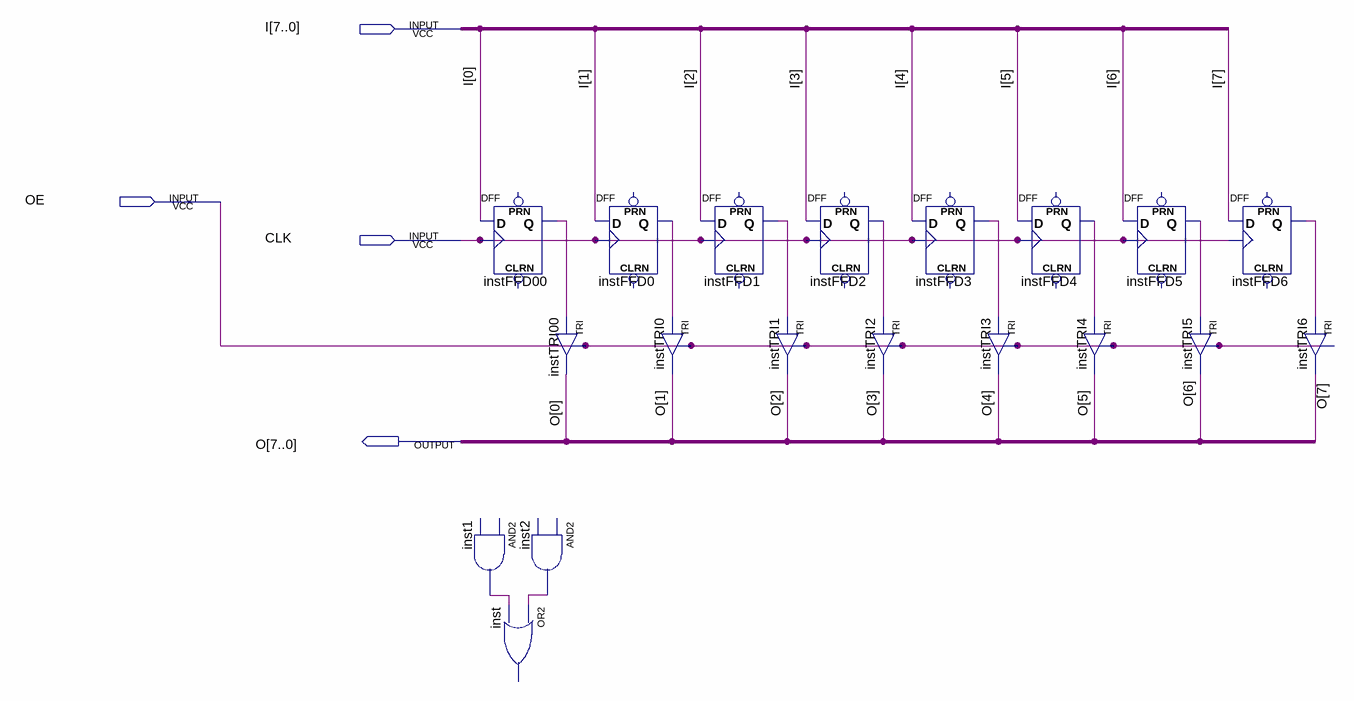
[diagram p0: schematic sheet]
// Quartus schematic Register8bitBasic.bdf as structural Verilog: 19 symbols, 4 pins
module Register8bitBasic (
  input  [7:0] I,
  input  OE,
  input  CLK,
  output [7:0] O
);

  wire inst1_out, inst2_out, instFFD00_q, instFFD0_q, instFFD1_q, instFFD2_q, instFFD3_q, instFFD4_q,
       instFFD5_q, instFFD6_q;

  DFF instFFD00 (.CLK(CLK), .D(I[0]), .Q(instFFD00_q));  // open: CLRN, PRN
  // AND2 inst1 has open pins: IN1=open, IN2=open, OUT=inst1_out
  // AND2 inst2 has open pins: IN1=open, IN2=open, OUT=inst2_out
  // OR2 inst has open pins: IN1=inst2_out, IN2=inst1_out, OUT=open
  DFF instFFD0 (.CLK(CLK), .D(I[1]), .Q(instFFD0_q));  // open: CLRN, PRN
  TRI instTRI00 (.IN(instFFD00_q), .OE(OE), .OUT(O[0]));
  TRI instTRI0 (.IN(instFFD0_q), .OE(OE), .OUT(O[1]));
  DFF instFFD1 (.CLK(CLK), .D(I[2]), .Q(instFFD1_q));  // open: CLRN, PRN
  DFF instFFD2 (.CLK(CLK), .D(I[3]), .Q(instFFD2_q));  // open: CLRN, PRN
  TRI instTRI1 (.IN(instFFD1_q), .OE(OE), .OUT(O[2]));
  TRI instTRI2 (.IN(instFFD2_q), .OE(OE), .OUT(O[3]));
  DFF instFFD3 (.CLK(CLK), .D(I[4]), .Q(instFFD3_q));  // open: CLRN, PRN
  TRI instTRI3 (.IN(instFFD3_q), .OE(OE), .OUT(O[4]));
  DFF instFFD4 (.CLK(CLK), .D(I[5]), .Q(instFFD4_q));  // open: CLRN, PRN
  DFF instFFD5 (.CLK(CLK), .D(I[6]), .Q(instFFD5_q));  // open: CLRN, PRN
  TRI instTRI4 (.IN(instFFD4_q), .OE(OE), .OUT(O[5]));
  TRI instTRI5 (.IN(instFFD5_q), .OE(OE), .OUT(O[6]));
  DFF instFFD6 (.CLK(CLK), .D(I[7]), .Q(instFFD6_q));  // open: CLRN, PRN
  TRI instTRI6 (.IN(instFFD6_q), .OE(OE), .OUT(O[7]));
endmodule
